# Altium schematic sheet others.SchDoc
size A4; SheetNumber: 6; SheetTotal: 7; NameOfSheet: PWM channels
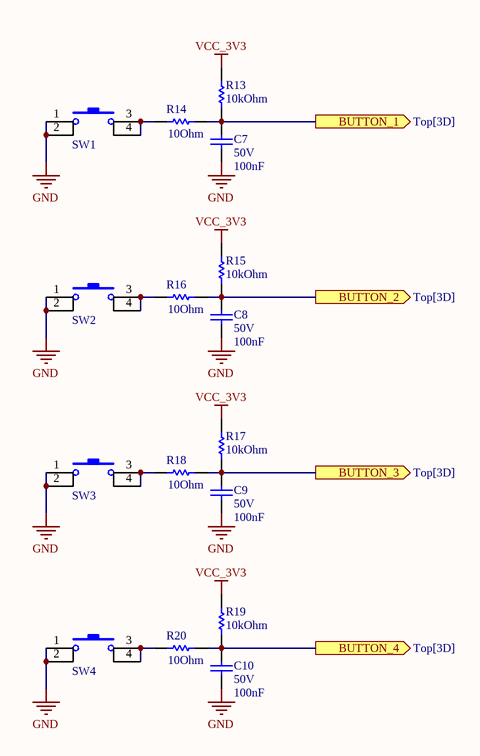
[diagram p0: others.SchDoc]

## Parts
C7  Voltage: 50V  Capacitance: 100nF  [CAP_0603_High_density]
C8  Voltage: 50V  Capacitance: 100nF  [CAP_0603_High_density]
C9  Voltage: 50V  Capacitance: 100nF  [CAP_0603_High_density]
C10  Voltage: 50V  Capacitance: 100nF  [CAP_0603_High_density]
R13  Resistance: 10kOhm  [RES_0603]  (hidden comment: 0603 10kOhm 1%)
R14  Resistance: 10Ohm  [RES_0603]  (hidden comment: 0603 10Ohm 1%)
R15  Resistance: 10kOhm  [RES_0603]  (hidden comment: 0603 10kOhm 1%)
R16  Resistance: 10Ohm  [RES_0603]  (hidden comment: 0603 10Ohm 1%)
R17  Resistance: 10kOhm  [RES_0603]  (hidden comment: 0603 10kOhm 1%)
R18  Resistance: 10Ohm  [RES_0603]  (hidden comment: 0603 10Ohm 1%)
R19  Resistance: 10kOhm  [RES_0603]  (hidden comment: 0603 10kOhm 1%)
R20  Resistance: 10Ohm  [RES_0603]  (hidden comment: 0603 10Ohm 1%)
SW1  SWITCH SMD  [B3FS-1010]  (value not drawn)
SW2  SWITCH SMD  [B3FS-1010]  (value not drawn)
SW3  SWITCH SMD  [B3FS-1010]  (value not drawn)
SW4  SWITCH SMD  [B3FS-1010]  (value not drawn)

## Ports
BUTTON_1 (out, see Top[3D]), BUTTON_2 (out, see Top[3D]), BUTTON_3 (out, see Top[3D]), BUTTON_4 (out, see Top[3D])

## Nets
GND: C7.2 C8.2 C9.2 C10.2 SW1.1 SW1.2 SW2.1 SW2.2 SW3.1 SW3.2 SW4.1 SW4.2
VCC_3V3: R13.1 R15.1 R17.1 R19.1
BUTTON_1: C7.1 R13.2 R14.2 ; port BUTTON_1
BUTTON_2: C8.1 R15.2 R16.2 ; port BUTTON_2
BUTTON_3: C9.1 R17.2 R18.2 ; port BUTTON_3
BUTTON_4: C10.1 R19.2 R20.2 ; port BUTTON_4
NetR14_1: R14.1 SW1.3 SW1.4
NetR16_1: R16.1 SW2.3 SW2.4
NetR18_1: R18.1 SW3.3 SW3.4
NetR20_1: R20.1 SW4.3 SW4.4

## Notes on the sheet
- Author:
- Sheet:
- /
- Issue date:
- Project name:
- Revision:
- Date:
- Page name:

## Library data of the parts
C7-C10 = Capacitor SMD: Generic Ceramic Capacitor SMD; Temperature Coefficient: X7R; Tolerance: 10%; Package: 0603; Supplier 1: LCSC; Supplier Part Number 1: C282519
R13-R20 = Resistor SMD_1: Generic Resistor SMD; Supplier 1: LCSC
  R13 R15 R17 R19: Manufacturer Part Number: 0603 10kOhm 1%; Supplier Part Number 1: C3017715
  R14 R16 R18 R20: Manufacturer Part Number: 0603 10Ohm 1%; Supplier Part Number 1: C22859
SW1-SW4 = B3FS-1010: SMD SWITCH B3FS-1010; Wartość: B3FS-1010; Supplier 1: LCSC; Supplier Part Number 1: C231324